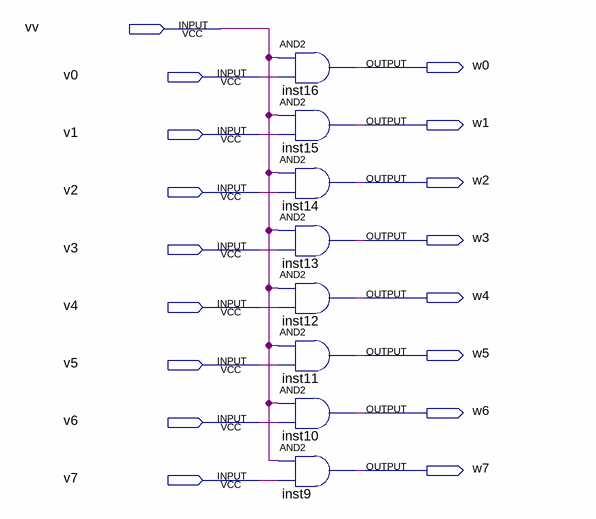
[diagram p0: schematic sheet]
// Quartus schematic chuanshu.bdf as structural Verilog: 8 symbols, 17 pins
module chuanshu (
  input  vv,
  input  v0,
  input  v1,
  input  v2,
  input  v3,
  input  v4,
  input  v5,
  input  v6,
  input  v7,
  output w0,
  output w1,
  output w2,
  output w3,
  output w4,
  output w5,
  output w6,
  output w7
);

  and inst16 (w0, vv, v0);
  and inst15 (w1, vv, v1);
  and inst14 (w2, vv, v2);
  and inst13 (w3, vv, v3);
  and inst12 (w4, vv, v4);
  and inst11 (w5, vv, v5);
  and inst10 (w6, vv, v6);
  and inst9 (w7, vv, v7);
endmodule
